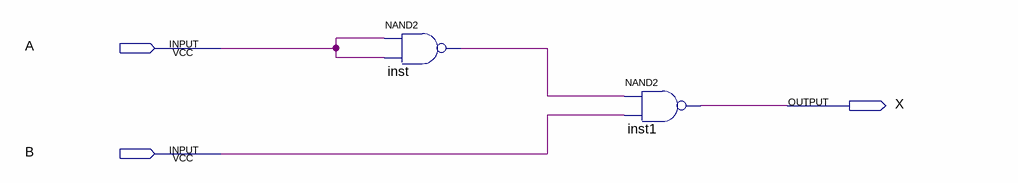
[diagram p0: schematic sheet]
// Quartus schematic nand_logic1.bdf as structural Verilog: 2 symbols, 3 pins
module nand_logic1 (
  input  A,
  input  B,
  output X
);

  wire inst_out;

  nand inst (inst_out, A, A);
  nand inst1 (X, inst_out, B);
endmodule
